# EAGLE design sigma_mix (EAGLE 7.6.0)

## Sheet 1 of 3: POWER
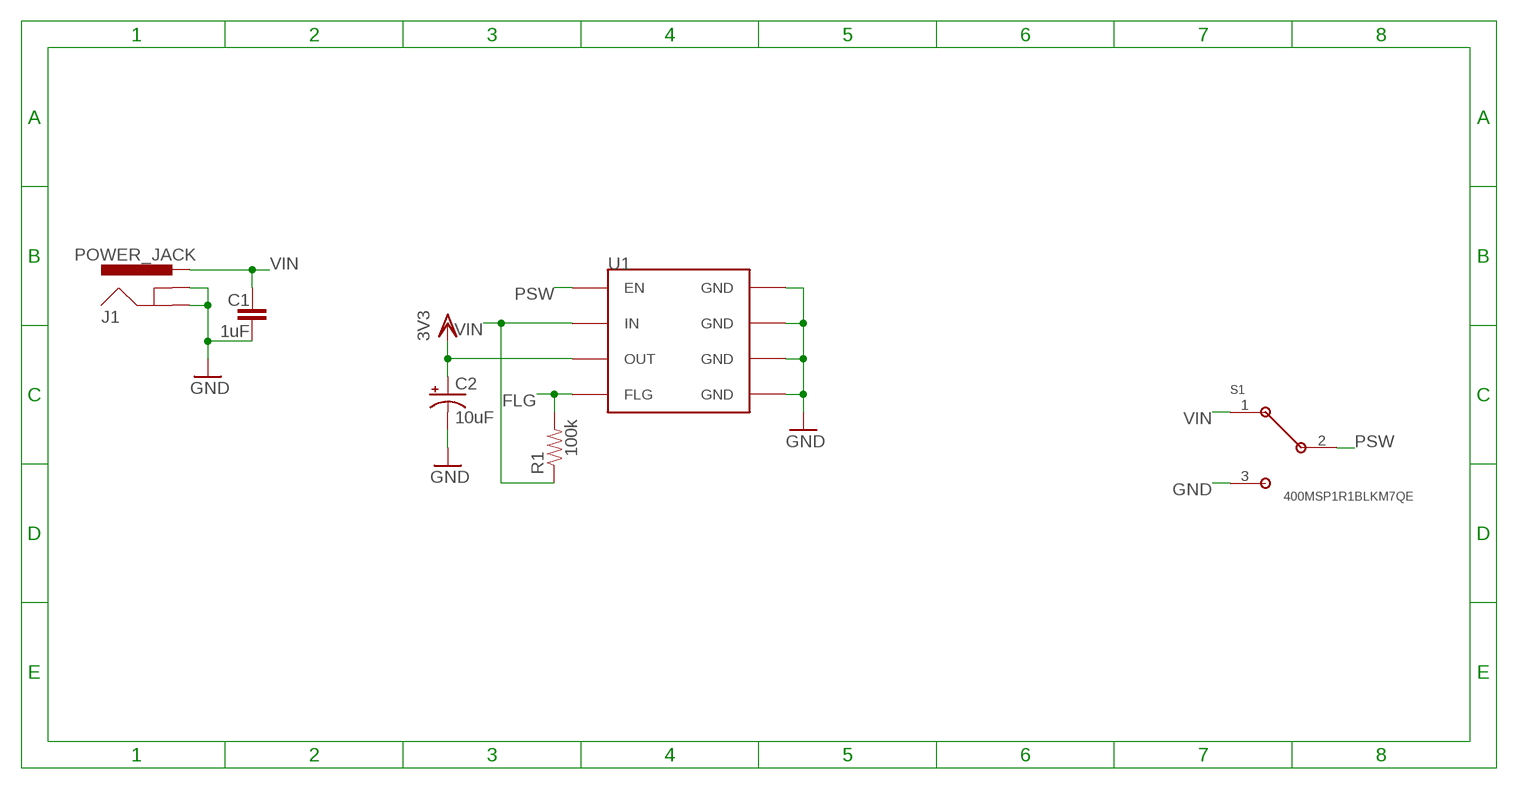
[diagram p0: schematic, sheet 1]

### Parts
C1  1uF  C-EUC2012  [C2012]
C2  10uF  CPOL-USR/2012-12R  [R/2012-12R]
J1  POWER_JACK  POWER_JACKPTH_LOCK  [POWER_JACK_PTH_LOCK]
R1  100k  RESISTOR0603-RES  [0603-RES]
S1  400MSP1R1BLKM7QE  [400MSP1R1BLKM7QE]
U1  MIC39100  [SOIC8]

### Nets
FLG: R1.2 U1.4(FLG)
GND: C1.2 C2.- J1.GND J1.GNDBREAK S1.3 U1.5(GND) U1.6(GND) U1.7(GND) U1.8(GND) ; also sheet 2,3
PSW: S1.2 U1.1(EN)
VDD: C2.+ U1.3(OUT) ; supply symbol labelled 3V3 ; also sheet 2,3
VIN: C1.1 J1.PWR R1.1 S1.1 U1.2(IN)

## Sheet 2 of 3: BLE
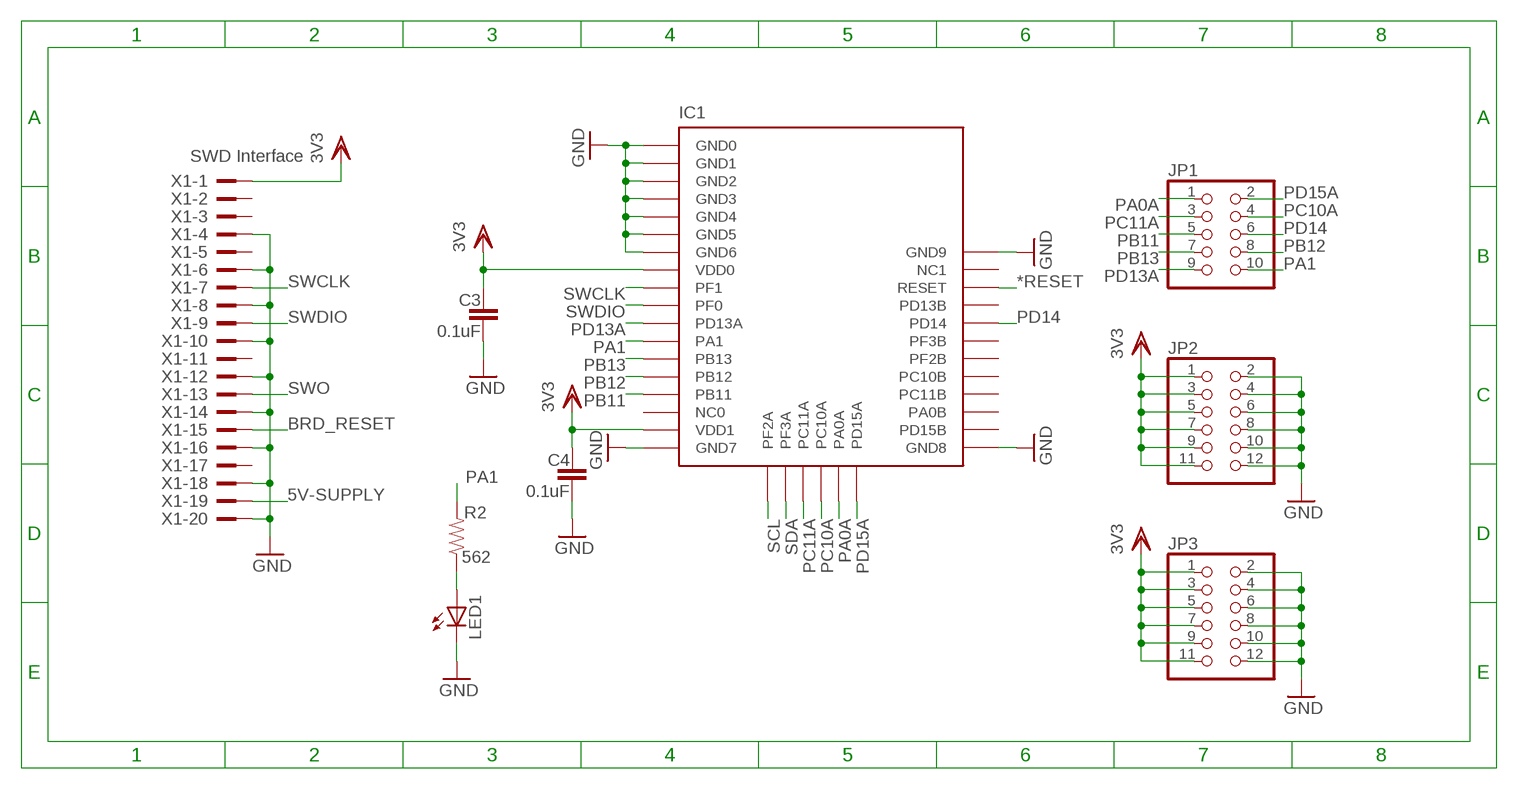
[diagram p1: schematic, sheet 2]

### Parts
C3  0.1uF  C-EUC2012  [C2012]
C4  0.1uF  C-EUC2012  [C2012]
IC1  BGM113  [BLE113]
JP1  PINHD-2X5  [2X05]
JP2  PINHD-2X6  [2X06]
JP3  PINHD-2X6  [2X06]
LED1  LEDCHIPLED_1206  [CHIPLED_1206]
R2  562  RESISTOR0603-RES  [0603-RES]
X1  SWD Interface  2520-  [PAK100/2500-20]

### Nets
5V-SUPPLY: X1.19
*RESET: IC1.P$34(RESET) ; also sheet 3
BRD_RESET: X1.15 ; also sheet 3
GND: C3.2 C4.2 IC1.P$1(GND0) IC1.P$2(GND1) IC1.P$3(GND2) IC1.P$4(GND3) IC1.P$5(GND4) IC1.P$6(GND5) IC1.P$7(GND6) IC1.P$18(GND7) IC1.P$25(GND8) IC1.P$36(GND9) JP2.2 JP2.4 JP2.6 JP2.8 JP2.10 JP2.12 JP3.2 JP3.4 JP3.6 JP3.8 JP3.10 JP3.12 LED1.C X1.4 X1.6 X1.8 X1.10 X1.12 X1.14 X1.16 X1.18 X1.20 ; also sheet 1,3
N$13: LED1.A R2.1
PA0A: IC1.P$23(PA0A) JP1.1
PA1: IC1.P$12(PA1) JP1.10 R2.2
PB11: IC1.P$15(PB11) JP1.5
PB12: IC1.P$14(PB12) JP1.8
PB13: IC1.P$13(PB13) JP1.7
PC10A: IC1.P$22(PC10A) JP1.4
PC11A: IC1.P$21(PC11A) JP1.3
PD13A: IC1.P$11(PD13A) JP1.9
PD14: IC1.P$32(PD14) JP1.6
PD15A: IC1.P$24(PD15A) JP1.2
SCL: IC1.P$19(PF2A) ; also sheet 3
SDA: IC1.P$20(PF3A) ; also sheet 3
SWCLK: IC1.P$9(PF1) X1.7
SWDIO: IC1.P$10(PF0) X1.9
SWO: X1.13
VDD: C3.1 C4.1 IC1.P$8(VDD0) IC1.P$17(VDD1) JP2.1 JP2.3 JP2.5 JP2.7 JP2.9 JP2.11 JP3.1 JP3.3 JP3.5 JP3.7 JP3.9 JP3.11 X1.1 ; supply symbol labelled 3V3 ; also sheet 1,3
Unconnected: IC1.P$16(NC0) IC1.P$26(PD15B) IC1.P$27(PA0B) IC1.P$28(PC11B) IC1.P$29(PC10B) IC1.P$30(PF2B) IC1.P$31(PF3B) IC1.P$33(PD13B) IC1.P$35(NC1) X1.2 X1.3 X1.5 X1.11 X1.17

## Sheet 3 of 3: DSP
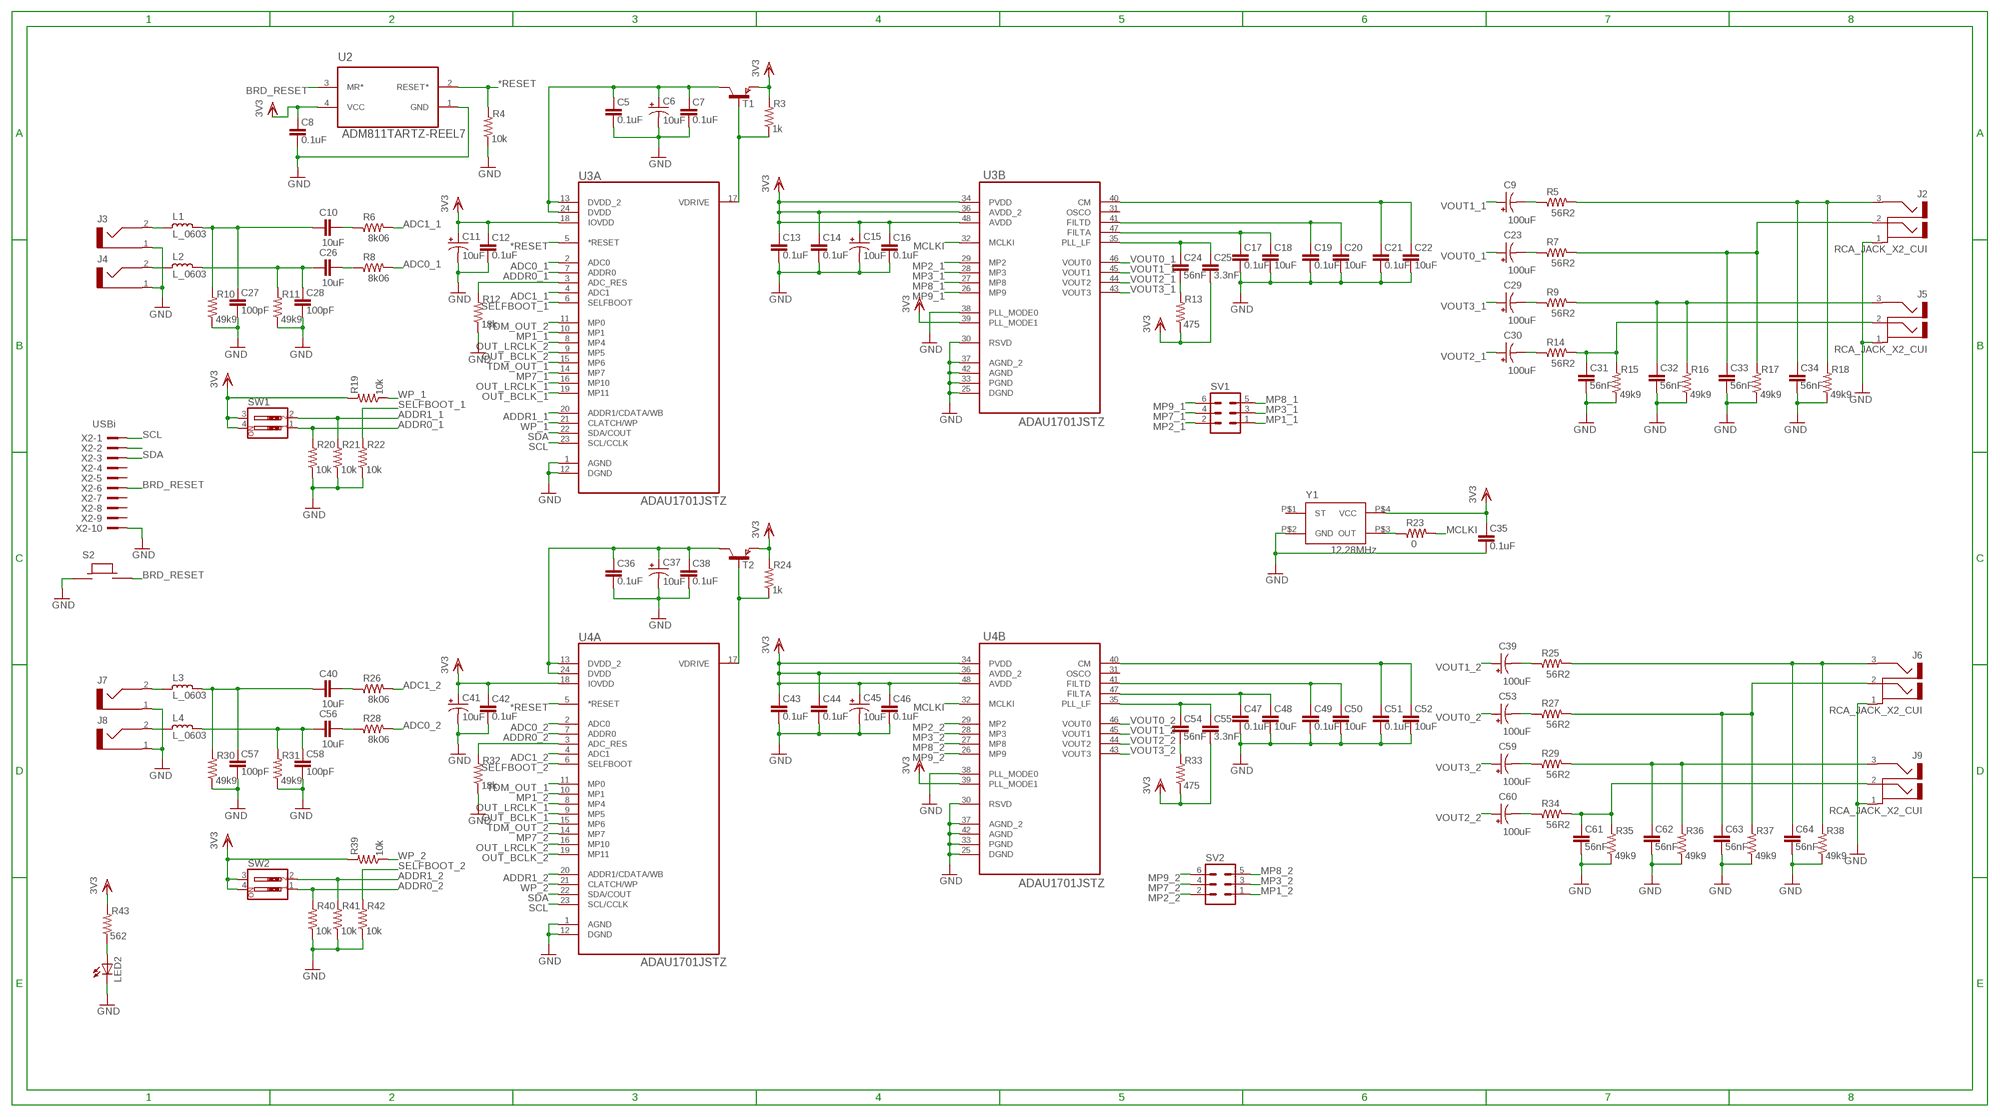
[diagram p2: schematic, sheet 3]

### Parts
C5  0.1uF  C-EUC2012  [C2012]
C6  10uF  CPOL-USR/2012-12R  [R/2012-12R]
C7  0.1uF  C-EUC2012  [C2012]
C8  0.1uF  C-EUC2012  [C2012]
C9  100uF  CPOL-USB/3528-21R  [B/3528-21R]
C10  10uF  C-EUC2012  [C2012]
C11  10uF  CPOL-USR/2012-12R  [R/2012-12R]
C12  0.1uF  C-EUC2012  [C2012]
C13  0.1uF  C-EUC2012  [C2012]
C14  0.1uF  C-EUC2012  [C2012]
C15  10uF  CPOL-USR/2012-12R  [R/2012-12R]
C16  0.1uF  C-EUC2012  [C2012]
C17  0.1uF  C-EUC2012  [C2012]
C18  10uF  C-EUC2012  [C2012]
C19  0.1uF  C-EUC2012  [C2012]
C20  10uF  C-EUC2012  [C2012]
C21  0.1uF  C-EUC2012  [C2012]
C22  10uF  C-EUC2012  [C2012]
C23  100uF  CPOL-USB/3528-21R  [B/3528-21R]
C24  56nF  C-EUC2012  [C2012]
C25  3.3nF  C-EUC2012  [C2012]
C26  10uF  C-EUC2012  [C2012]
C27  100pF  C-EUC2012  [C2012]
C28  100pF  C-EUC2012  [C2012]
C29  100uF  CPOL-USB/3528-21R  [B/3528-21R]
C30  100uF  CPOL-USB/3528-21R  [B/3528-21R]
C31  56nF  C-EUC2012  [C2012]
C32  56nF  C-EUC2012  [C2012]
C33  56nF  C-EUC2012  [C2012]
C34  56nF  C-EUC2012  [C2012]
C35  0.1uF  C-EUC2012  [C2012]
C36  0.1uF  C-EUC2012  [C2012]
C37  10uF  CPOL-USR/2012-12R  [R/2012-12R]
C38  0.1uF  C-EUC2012  [C2012]
C39  100uF  CPOL-USB/3528-21R  [B/3528-21R]
C40  10uF  C-EUC2012  [C2012]
C41  10uF  CPOL-USR/2012-12R  [R/2012-12R]
C42  0.1uF  C-EUC2012  [C2012]
C43  0.1uF  C-EUC2012  [C2012]
C44  0.1uF  C-EUC2012  [C2012]
C45  10uF  CPOL-USR/2012-12R  [R/2012-12R]
C46  0.1uF  C-EUC2012  [C2012]
C47  0.1uF  C-EUC2012  [C2012]
C48  10uF  C-EUC2012  [C2012]
C49  0.1uF  C-EUC2012  [C2012]
C50  10uF  C-EUC2012  [C2012]
C51  0.1uF  C-EUC2012  [C2012]
C52  10uF  C-EUC2012  [C2012]
C53  100uF  CPOL-USB/3528-21R  [B/3528-21R]
C54  56nF  C-EUC2012  [C2012]
C55  3.3nF  C-EUC2012  [C2012]
C56  10uF  C-EUC2012  [C2012]
C57  100pF  C-EUC2012  [C2012]
C58  100pF  C-EUC2012  [C2012]
C59  100uF  CPOL-USB/3528-21R  [B/3528-21R]
C60  100uF  CPOL-USB/3528-21R  [B/3528-21R]
C61  56nF  C-EUC2012  [C2012]
C62  56nF  C-EUC2012  [C2012]
C63  56nF  C-EUC2012  [C2012]
C64  56nF  C-EUC2012  [C2012]
J2  RCA_JACK_X2_CUI  [RCA_JACK_X2_CUI]
J3  RCA_JACK_CUI  [RCA_JACK_CUI]
J4  RCA_JACK_CUI  [RCA_JACK_CUI]
J5  RCA_JACK_X2_CUI  [RCA_JACK_X2_CUI]
J6  RCA_JACK_X2_CUI  [RCA_JACK_X2_CUI]
J7  RCA_JACK_CUI  [RCA_JACK_CUI]
J8  RCA_JACK_CUI  [RCA_JACK_CUI]
J9  RCA_JACK_X2_CUI  [RCA_JACK_X2_CUI]
L1  L_0603  [L0603]
L2  L_0603  [L0603]
L3  L_0603  [L0603]
L4  L_0603  [L0603]
LED2  LEDCHIPLED_1206  [CHIPLED_1206]
R3  1k  RESISTOR0603-RES  [0603-RES]
R4  10k  RESISTOR0603-RES  [0603-RES]
R5  56R2  RESISTOR0603-RES  [0603-RES]
R6  8k06  RESISTOR0603-RES  [0603-RES]
R7  56R2  RESISTOR0603-RES  [0603-RES]
R8  8k06  RESISTOR0603-RES  [0603-RES]
R9  56R2  RESISTOR0603-RES  [0603-RES]
R10  49k9  RESISTOR0603-RES  [0603-RES]
R11  49k9  RESISTOR0603-RES  [0603-RES]
R12  18k  RESISTOR0603-RES  [0603-RES]
R13  475  RESISTOR0603-RES  [0603-RES]
R14  56R2  RESISTOR0603-RES  [0603-RES]
R15  49k9  RESISTOR0603-RES  [0603-RES]
R16  49k9  RESISTOR0603-RES  [0603-RES]
R17  49k9  RESISTOR0603-RES  [0603-RES]
R18  49k9  RESISTOR0603-RES  [0603-RES]
R19  10k  RESISTOR0603-RES  [0603-RES]
R20  10k  RESISTOR0603-RES  [0603-RES]
R21  10k  RESISTOR0603-RES  [0603-RES]
R22  10k  RESISTOR0603-RES  [0603-RES]
R23  0  RESISTOR0603-RES  [0603-RES]
R24  1k  RESISTOR0603-RES  [0603-RES]
R25  56R2  RESISTOR0603-RES  [0603-RES]
R26  8k06  RESISTOR0603-RES  [0603-RES]
R27  56R2  RESISTOR0603-RES  [0603-RES]
R28  8k06  RESISTOR0603-RES  [0603-RES]
R29  56R2  RESISTOR0603-RES  [0603-RES]
R30  49k9  RESISTOR0603-RES  [0603-RES]
R31  49k9  RESISTOR0603-RES  [0603-RES]
R32  18k  RESISTOR0603-RES  [0603-RES]
R33  475  RESISTOR0603-RES  [0603-RES]
R34  56R2  RESISTOR0603-RES  [0603-RES]
R35  49k9  RESISTOR0603-RES  [0603-RES]
R36  49k9  RESISTOR0603-RES  [0603-RES]
R37  49k9  RESISTOR0603-RES  [0603-RES]
R38  49k9  RESISTOR0603-RES  [0603-RES]
R39  10k  RESISTOR0603-RES  [0603-RES]
R40  10k  RESISTOR0603-RES  [0603-RES]
R41  10k  RESISTOR0603-RES  [0603-RES]
R42  10k  RESISTOR0603-RES  [0603-RES]
R43  562  RESISTOR0603-RES  [0603-RES]
S2  OMRON_B3M  [OMRON_B3M]
SV1  MA03-2  [MA03-2]
SV2  MA03-2  [MA03-2]
SW1  SW_DIP-2  [EDG-02]
SW2  SW_DIP-2  [EDG-02]
T1  PNPSOT23  [SOT-23]
T2  PNPSOT23  [SOT-23]
U2  ADM811TARTZ-REEL7  [SOT143P290X130-4N]
U3  ADAU1701JSTZ  [QFP50P900X900X160-48N]
U4  ADAU1701JSTZ  [QFP50P900X900X160-48N]
X2  USBi  2510-  [PAK100/2500-10]
Y1  12.28MHz  XTAL-OSC  [SG-210]

### Nets
*RESET: R4.2 U2.2(RESET*) U3.5(A:*RESET) U4.5(A:*RESET) ; also sheet 2
ADC0_1: R8.2 U3.2(A:ADC0)
ADC0_2: R28.2 U4.2(A:ADC0)
ADC1_1: R6.2 U3.4(A:ADC1)
ADC1_2: R26.2 U4.4(A:ADC1)
ADDR0_1: R20.2 SW1.1 U3.7(A:ADDR0)
ADDR0_2: R40.2 SW2.1 U4.7(A:ADDR0)
ADDR1_1: R21.2 SW1.2 U3.20(A:ADDR1/CDATA/WB)
ADDR1_2: R41.2 SW2.2 U4.20(A:ADDR1/CDATA/WB)
BRD_RESET: S2.P$2 U2.3(MR*) X2.6 ; also sheet 2
DVDD: C5.1 C6.+ C7.1 T1.1(C) U3.13(A:DVDD_2) U3.24(A:DVDD)
GND: C5.2 C6.- C7.2 C8.2 C11.- C12.2 C13.2 C14.2 C15.- C16.2 C17.2 C18.2 C19.2 C20.2 C21.2 C22.2 C27.2 C28.2 C31.2 C32.2 C33.2 C34.2 C35.2 C36.2 C37.- C38.2 C41.- C42.2 C43.2 C44.2 C45.- C46.2 C47.2 C48.2 C49.2 C50.2 C51.2 C52.2 C57.2 C58.2 C61.2 C62.2 C63.2 C64.2 J2.1 J3.1 J4.1 J5.1 J6.1 J7.1 J8.1 J9.1 LED2.C R4.1 R10.1 R11.1 R12.1 R15.1 R16.1 R17.1 R18.1 R20.1 R21.1 R22.1 R30.1 R31.1 R32.1 R35.1 R36.1 R37.1 R38.1 R40.1 R41.1 R42.1 S2.P$1 U2.1(GND) U3.1(A:AGND) U3.12(A:DGND) U3.25(B:DGND) U3.30(B:RSVD) U3.33(B:PGND) U3.37(B:AGND_2) U3.38(B:PLL_MODE0) U3.42(B:AGND) U4.1(A:AGND) U4.12(A:DGND) U4.25(B:DGND) U4.30(B:RSVD) U4.33(B:PGND) U4.37(B:AGND_2) U4.38(B:PLL_MODE0) U4.42(B:AGND) X2.10 Y1.P$2(GND) ; also sheet 1,2
MCLKI: R23.2 U3.32(B:MCLKI) U4.32(B:MCLKI)
MP1_1: SV1.1 U3.10(A:MP1)
MP1_2: SV2.1 U4.10(A:MP1)
MP2_1: SV1.2 U3.29(B:MP2)
MP2_2: SV2.2 U4.29(B:MP2)
MP3_1: SV1.3 U3.28(B:MP3)
MP3_2: SV2.3 U4.28(B:MP3)
MP7_1: SV1.4 U3.14(A:MP7)
MP7_2: SV2.4 U4.14(A:MP7)
MP8_1: SV1.5 U3.27(B:MP8)
MP8_2: SV2.5 U4.27(B:MP8)
MP9_1: SV1.6 U3.26(B:MP9)
MP9_2: SV2.6 U4.26(B:MP9)
N$1: R3.1 T1.3(B) U3.17(A:VDRIVE)
N$2: C24.2 R13.2
N$3: C24.1 C25.1 U3.35(B:PLL_LF)
N$4: C17.1 C18.1 U3.47(B:FILTA)
N$5: R23.1 Y1.P$3(OUT)
N$6: C19.1 C20.1 U3.41(B:FILTD)
N$7: C21.1 C22.1 U3.40(B:CM)
N$8: R12.2 U3.3(A:ADC_RES)
N$9: LED2.A R43.1
N$10: C10.2 C27.1 L1.1 R10.2
N$11: X2.2
N$12: C10.1 R6.1
N$15: C26.2 C28.1 L2.1 R11.2
N$16: C26.1 R8.1
N$19: C9.- R5.1
N$20: J3.2 L1.2
N$21: C23.- R7.1
N$22: C29.- R9.1
N$24: C30.- R14.1
N$26: C31.1 J5.2 R14.2 R15.2
N$28: C32.1 J5.3 R9.2 R16.2
N$33: C33.1 J2.2 R7.2 R17.2
N$34: C34.1 J2.3 R5.2 R18.2
N$35: J4.2 L2.2
N$36: R24.1 T2.3(B) U4.17(A:VDRIVE)
N$37: C36.1 C37.+ C38.1 T2.1(C) U4.13(A:DVDD_2) U4.24(A:DVDD)
N$38: C54.2 R33.2
N$39: C54.1 C55.1 U4.35(B:PLL_LF)
N$40: C47.1 C48.1 U4.47(B:FILTA)
N$41: C49.1 C50.1 U4.41(B:FILTD)
N$42: C51.1 C52.1 U4.40(B:CM)
N$44: R32.2 U4.3(A:ADC_RES)
N$46: C40.2 C57.1 L3.1 R30.2
N$47: C40.1 R26.1
N$48: C56.2 C58.1 L4.1 R31.2
N$49: C56.1 R28.1
N$50: C39.- R25.1
N$51: C53.- R27.1
N$52: C59.- R29.1
N$53: C60.- R34.1
N$54: C61.1 J9.2 R34.2 R35.2
N$55: C62.1 J9.3 R29.2 R36.2
N$56: C63.1 J6.2 R27.2 R37.2
N$57: C64.1 J6.3 R25.2 R38.2
N$58: J7.2 L3.2
N$59: J8.2 L4.2
OUT_BCLK_1: U3.19(A:MP11) U4.9(A:MP5)
OUT_BCLK_2: U3.9(A:MP5) U4.19(A:MP11)
OUT_LRCLK_1: U3.16(A:MP10) U4.8(A:MP4)
OUT_LRCLK_2: U3.8(A:MP4) U4.16(A:MP10)
SCL: U3.23(A:SCL/CCLK) U4.23(A:SCL/CCLK) X2.1 ; also sheet 2
SDA: U3.22(A:SDA/COUT) U4.22(A:SDA/COUT) X2.3 ; also sheet 2
SELFBOOT_1: R22.2 U3.6(A:SELFBOOT)
SELFBOOT_2: R42.2 U4.6(A:SELFBOOT)
TDM_OUT_1: U3.15(A:MP6) U4.11(A:MP0)
TDM_OUT_2: U3.11(A:MP0) U4.15(A:MP6)
VDD: C8.1 C11.+ C12.1 C13.1 C14.1 C15.+ C16.1 C25.2 C35.1 C41.+ C42.1 C43.1 C44.1 C45.+ C46.1 C55.2 R3.2 R13.1 R19.2 R24.2 R33.1 R39.2 R43.2 SW1.3 SW1.4 SW2.3 SW2.4 T1.2(E) T2.2(E) U2.4(VCC) U3.18(A:IOVDD) U3.34(B:PVDD) U3.36(B:AVDD_2) U3.39(B:PLL_MODE1) U3.48(B:AVDD) U4.18(A:IOVDD) U4.34(B:PVDD) U4.36(B:AVDD_2) U4.39(B:PLL_MODE1) U4.48(B:AVDD) Y1.P$4(VCC) ; supply symbol labelled 3V3 ; also sheet 1,2
VOUT0_1: C23.+ U3.46(B:VOUT0)
VOUT0_2: C53.+ U4.46(B:VOUT0)
VOUT1_1: C9.+ U3.45(B:VOUT1)
VOUT1_2: C39.+ U4.45(B:VOUT1)
VOUT2_1: C30.+ U3.44(B:VOUT2)
VOUT2_2: C60.+ U4.44(B:VOUT2)
VOUT3_1: C29.+ U3.43(B:VOUT3)
VOUT3_2: C59.+ U4.43(B:VOUT3)
WP_1: R19.1 U3.21(A:CLATCH/WP)
WP_2: R39.1 U4.21(A:CLATCH/WP)
Unconnected: U3.31(B:OSCO) U4.31(B:OSCO) X2.4 X2.5 X2.7 X2.8 X2.9 Y1.P$1(ST)

## Library data of the parts
C1 C3-C5 C7 C8 C10 C12-C14 C16-C22 C24-C28 C31-C36 C38 C40 C42-C44 C46-C52 C54-C58 C61-C64 = rcl:C-EU: CAPACITOR, European symbol
C2 C6 C9 C11 C15 C23 C29 C30 C37 C39 C41 C45 C53 C59 C60 = rcl:CPOL-US: POLARIZED CAPACITOR, American symbol
IC1 = tkrworks:BGM113
J1 = SparkFun:POWER_JACK: Power Jack This is the standard 5.5mm barrel jack for power. The PTH is the most common, proven, reliable, footprint. All others are experimental. The Slot footprint only works if the mill layer is transmitted to the PCB fab house so be warned. Spark Fun Electronics SKU : PRT-00119. Mating wall wart : TOL-00298 (and others)
J2 J5 J6 J9 = tkrworks:RCA_JACK_X2_CUI
J3 J4 J7 J8 = tkrworks:RCA_JACK_CUI
JP1 = pinhead:PINHD-2X5: PIN HEADER
JP2 JP3 = pinhead:PINHD-2X6: PIN HEADER
L1-L4 = rc-master-smd:L_: INDUCTOR
LED1 LED2 = myled:LED: LED OSRAM: - CHIPLED LG R971, LG N971, LY N971, LG Q971, LY Q971, LO R971, LY R971 LH N974, LH R974 LS Q976, LO Q976, LY Q976 LO Q996 - Hyper CHIPLED LW Q18S LB Q993, LB Q99A, LB R99A - SideLED LS A670, LO A670, LY A670, LG A670, LP A670 LB A673, LV A673, LT A673, LW A673 LH A674 LY A675 LS A676, LA A676, LO A676, LY A676, LW A676 LS A679, LY A679, LG A679 - Hyper Micro SIDELED® LS Y876, LA Y876, LO Y876, LY Y876 LT Y87S - SmartLED LW L88C, LW L88S LB L89C, LB L89S, LG L890 LS L89K, LO L89K, LY L89K LS L896, LA L896, LO L896, LY L896 - TOPLED LS T670, LO T670, LY T670, LG T670, LP T670 LSG T670, LSP T670, LSY T670, LOP T670, LYG T670 LG T671, LOG T671, LSG T671 LB T673, LV T673, LT T673, LW T673 LH T674 LS T676, LA T676, LO T676, LY T676, LB T676, LH T676, LSB T676, LW T676 LB T67C, LV T67C, LT T67C, LS T67K, LO T67K, LY T67K, LW E67C LS E67B, LA E67B, LO E67B, LY E67B, LB E67C, LV E67C, LT E67C LW T67C LS T679, LY T679, LG T679 LS T770, LO T770, LY T770, LG T770, LP T770 LB T773, LV T773, LT T773, LW T773 LH T774 LS E675, LA E675, LY E675, LS T675 LS T776, LA T776, LO T776, LY T776, LB T776 LHGB T686 LT T68C, LB T68C - Hyper Mini TOPLED® LB M676 - Mini TOPLED Santana® LG M470 LS M47K, LO M47K, LY M47K Source: http://www.osram.convergy.de LUXEON: - LUMILED® LXK2-PW12-R00, LXK2-PW12-S00, LXK2-PW14-U00, LXK2-PW14-V00 LXK2-PM12-R00, LXK2-PM12-S00, LXK2-PM14-U00 LXK2-PE12-Q00, LXK2-PE12-R00, LXK2-PE12-S00, LXK2-PE14-T00, LXK2-PE14-U00 LXK2-PB12-K00, LXK2-PB12-L00, LXK2-PB12-M00, LXK2-PB14-N00, LXK2-PB14-P00, LXK2-PB14-Q00 LXK2-PR12-L00, LXK2-PR12-M00, LXK2-PR14-Q00, LXK2-PR14-R00 LXK2-PD12-Q00, LXK2-PD12-R00, LXK2-PD12-S00 LXK2-PH12-R00, LXK2-PH12-S00 LXK2-PL12-P00, LXK2-PL12-Q00, LXK2-PL12-R00 Source: www.luxeon.com KINGBRIGHT: KA-3528ASYC Source: www.kingbright.com
R1-R43 = SparkFun:RESISTOR: Resistor Basic schematic elements and footprints for 0603, 1206, and PTH resistors.
S1 = tkrworks:400MSP1R1BLKM7QE
S2 = tkrworks:OMRON_B3M
SV1 SV2 = con-lstb:MA03-2: PIN HEADER; OC_FARNELL: unknown; OC_NEWARK: unknown
SW1 SW2 = special:SW_DIP-2: DIP SWITCH
T1 T2 = zetex:PNPSOT23: PNP TRANSISTOR; MPN: DSS20200L-7; OC_FARNELL: unknown; OC_NEWARK: 25R4554
U1 = tkrworks:MIC39100
U2 = ADI-Phase-2:ADM811TARTZ-REEL7: Microprocessor Supervisory Circuits
U3 U4 = ADI-Phase-2:ADAU1701JSTZ: SigmaDSP 28-/56-Bit Audio Processor; MPN: ADAU1701JSTZ; OC_FARNELL: 1498728; OC_NEWARK: 28M3496; PACKAGE: LQFP-48; SUPPLIER: Analog Devices
X1 = con-3m:2520-: 3M (TM) Pak 100 4-Wall Header Source: 3M; OC_FARNELL: unknown; OC_NEWARK: unknown
X2 = con-3m:2510-: 3M (TM) Pak 100 4-Wall Header Source: 3M; MF: 3M; MPN: 2510-6002UB; OC_FARNELL: 9838244; OC_NEWARK: 46F4725
Y1 = tkrworks2:XTAL-OSC

## Board
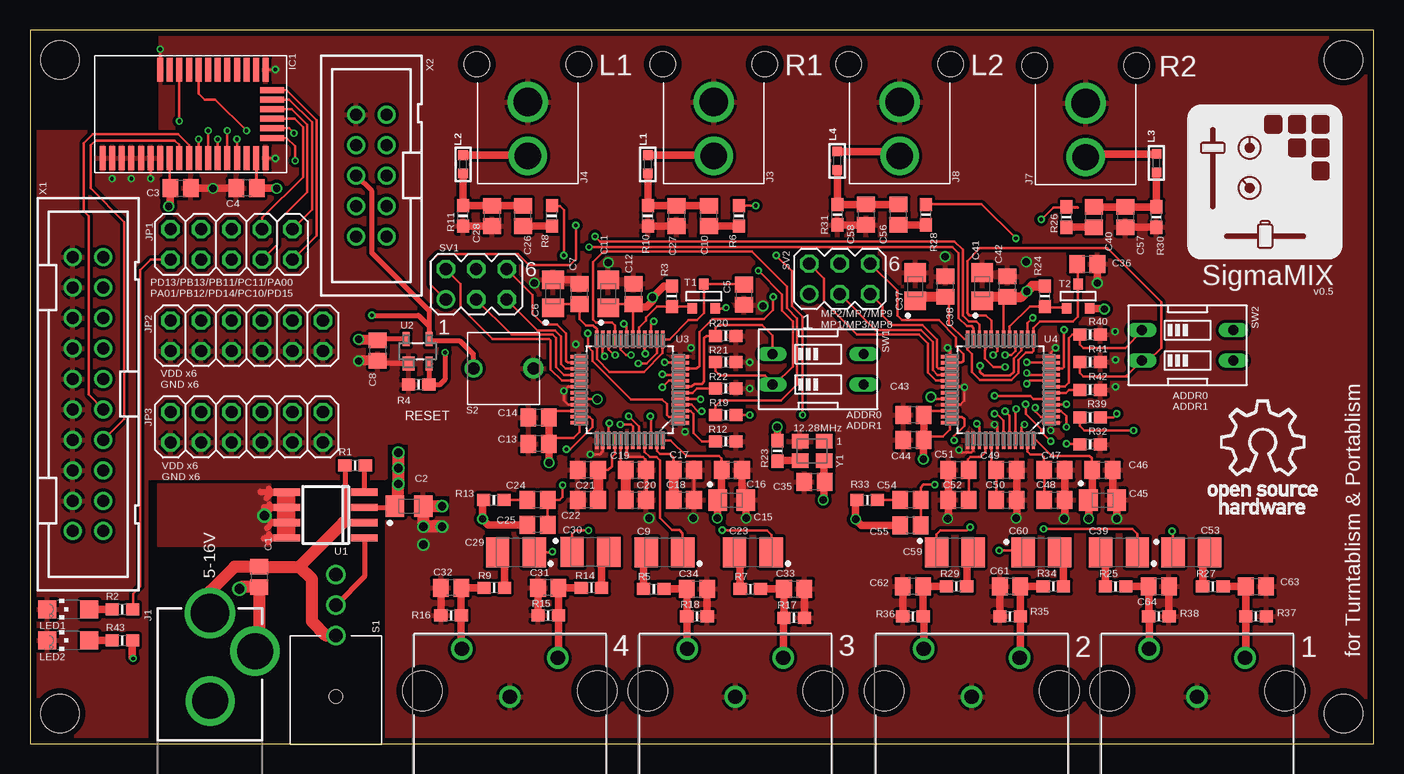
[diagram p3: board, top side]
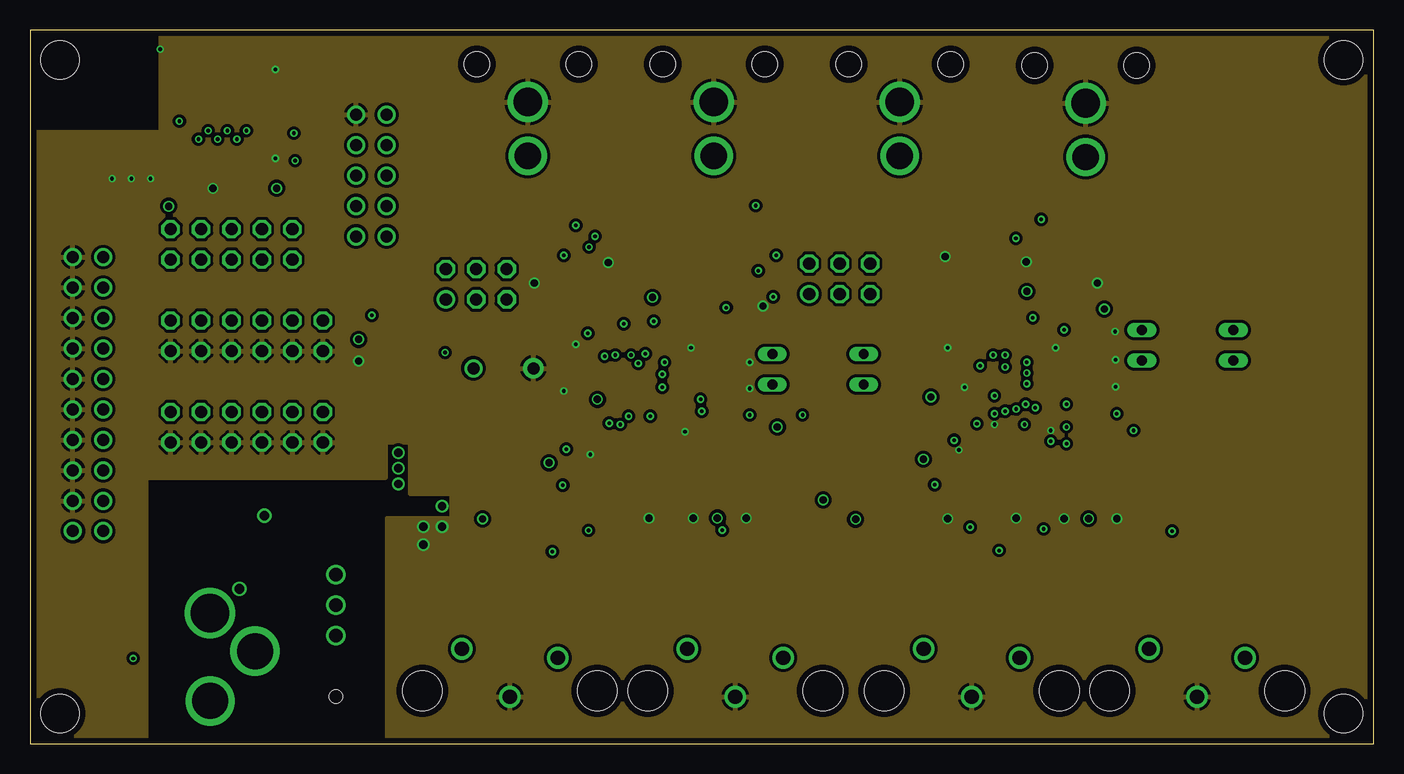
[diagram p4: board, inner layer Route2]
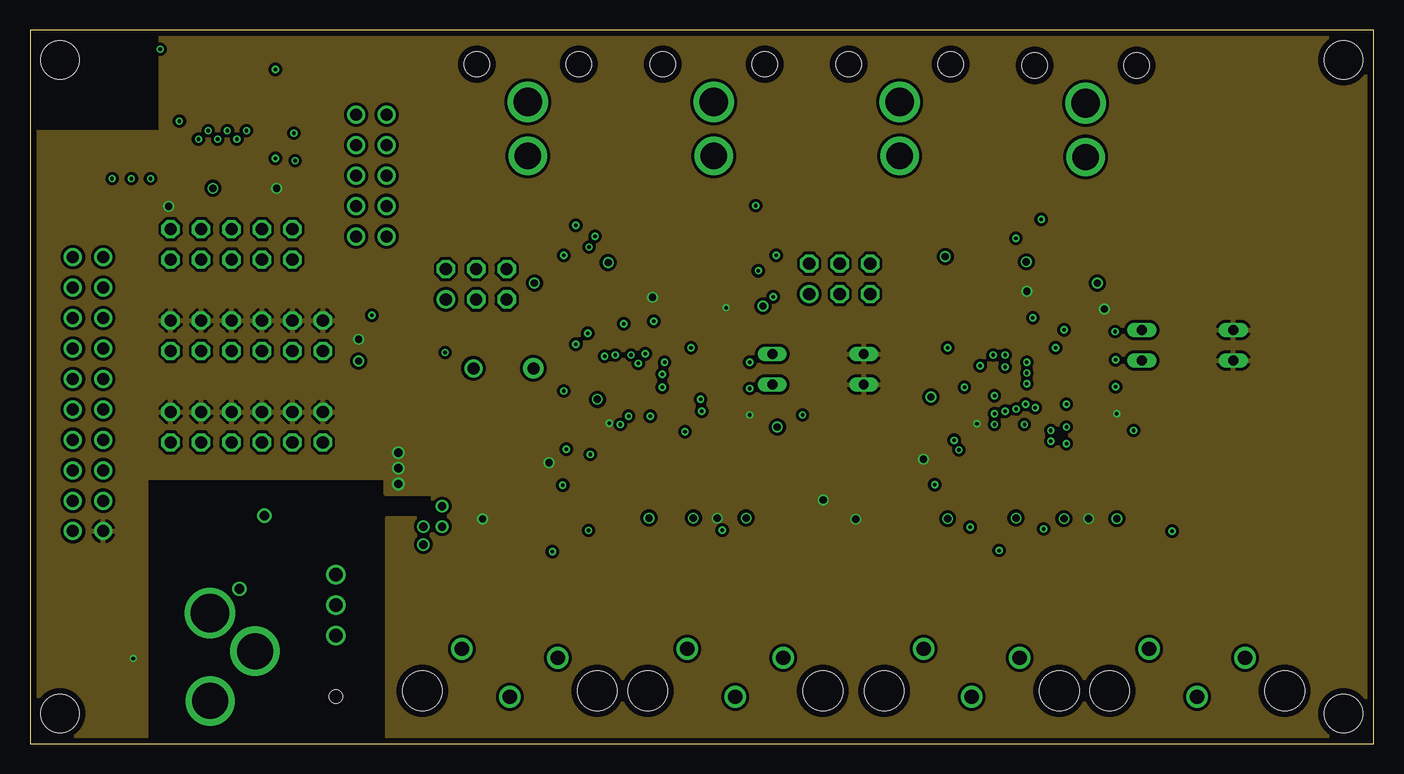
[diagram p5: board, inner layer Route3]
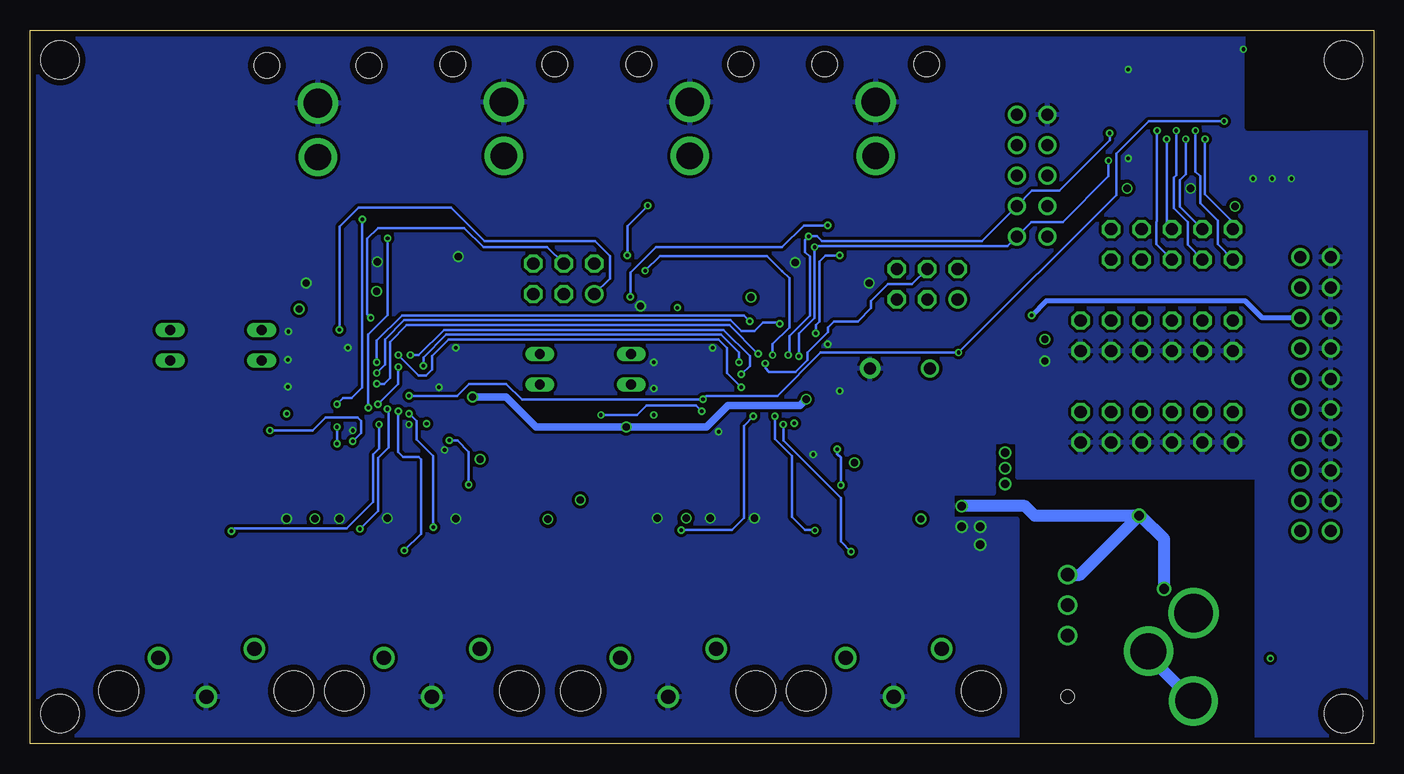
[diagram p6: board, bottom side, seen from below]

Size 112 x 59.5 mm. Coordinates in mm from the lower left corner, seen from the top.
Outline: 0,59.5 0,0 112,0 112,59.5 0,59.5
Copper layers (1+2*3+16): Top 0.018mm / dielectric 0.25mm / Route2 0.035mm / dielectric 1mm / Route3 0.035mm / dielectric 0.2mm / Bottom 0.018mm
Design rules "pban_5mil-l4-a": minimum track width 5mil, minimum drill 0.3mm, track to track 5mil, track to pad 0.229mm, pad to pad 5mil, via to via 5mil, smd to smd 5mil, copper to edge 0.5mm, drill to drill 0.5mm, minimum pad ring 0.15mm, minimum via ring 0.15mm, stop-mask expansion 4mil, vias tented up to drill 0.35mm, thermal gap 10mil
Holes 3.2 mm at 2.5,57 2.5,2.5 109.5,57 109.5,2.5

### Footprints (pad centres in the part's own frame; a part is rotated, then mirrored left to right if it is on the bottom)
C2012 = smd 1.3 x 1.5: 1 -0.85,0; 2 0.85,0
R/2012-12R = smd 1.55 x 1.8: + 1.175,0; - -1.175,0
B/3528-21R = smd 1.95 x 2.5: + 1.525,0; - -1.525,0
BLE113 = smd 2 x 0.5: P$1 -3.675,6.8; P$2 -3.675,6; P$3 -3.675,5.2; P$4 -3.675,4.4; P$5 -3.675,3.6; P$6 -3.675,2.8; P$7 -3.675,2; P$8 -3.675,1.2; P$9 -3.675,0.4; P$10 -3.675,-0.4; P$11 -3.675,-1.2; P$12 -3.675,-2; P$13 -3.675,-2.8; P$14 -3.675,-3.6; P$15 -3.675,-4.4; P$16 -3.675,-5.2; P$17 -3.675,-6; P$18 -3.675,-6.8; P$25 3.675,-6.8; P$26 3.675,-6; P$27 3.675,-5.2; P$28 3.675,-4.4; P$29 3.675,-3.6; P$30 3.675,-2.8; P$31 3.675,-2; P$32 3.675,-1.2; P$33 3.675,-0.4; P$34 3.675,0.4; P$35 3.675,1.2; P$36 3.675,2 | smd 0.5 x 2: P$19 -2,-7.35; P$20 -1.2,-7.35; P$21 -0.4,-7.35; P$22 0.4,-7.35; P$23 1.2,-7.35; P$24 2,-7.35
POWER_JACK_PTH_LOCK = drill 2.997 pad 4.115: GND 0.025,6.557; GNDBREAK 3.762,10.7 | drill 3.2 pad 4.115: PWR 0,13.878
RCA_JACK_X2_CUI = drill 1.2: 1 0,0; 2 -4,-3.25; 3 4,-4 | hole 3.3: -7.3,-0.5; 7.3,-0.5
RCA_JACK_CUI = drill 2.4: 1 -4,0 | drill 2.2: 2 -8.5,0 | hole 2.1: -0.85,-4.25; -0.85,4.25
2X05 = drill 1.016 octagon: 1 -5.08,-1.27; 2 -5.08,1.27; 3 -2.54,-1.27; 4 -2.54,1.27; 5 0,-1.27; 6 0,1.27; 7 2.54,-1.27; 8 2.54,1.27; 9 5.08,-1.27; 10 5.08,1.27
2X06 = drill 1.016 octagon: 1 -6.35,-1.27; 2 -6.35,1.27; 3 -3.81,-1.27; 4 -3.81,1.27; 5 -1.27,-1.27; 6 -1.27,1.27; 7 1.27,-1.27; 8 1.27,1.27; 9 3.81,-1.27; 10 3.81,1.27; 11 6.35,-1.27; 12 6.35,1.27
L0603 = smd 0.8 x 0.8: 1 -0.762,0; 2 0.762,0
CHIPLED_1206 = smd 1.5 x 1.5: A 0,-1.75; C 0,1.75
0603-RES = smd 1.1 x 1: 1 -0.85,0; 2 0.85,0
400MSP1R1BLKM7QE = drill 1.1: 1 0,0; 2 2.54,0; 3 5.08,0 | hole 1.1: -5.08,0
OMRON_B3M = drill 1 pad 1.676: P$1 -2.5,0 | drill 1: P$2 2.5,0
MA03-2 = drill 1.016: 1 -2.54,-1.27 | drill 1.016 octagon: 2 -2.54,1.27; 3 0,-1.27; 4 0,1.27; 5 2.54,-1.27; 6 2.54,1.27
EDG-02 = drill 0.813 long: 1 -1.27,-3.81; 2 1.27,-3.81; 3 1.27,3.81; 4 -1.27,3.81
SOT-23 = smd 0.787 x 0.889: 1 0.025,-1.016; 2 -0.94,1.016; 3 0.991,1.016
SOIC8 = smd 0.6 x 2.2: 1 -1.905,-3.235; 2 -0.635,-3.235; 3 0.635,-3.235; 4 1.905,-3.235; 5 1.905,3.235; 6 0.635,3.235; 7 -0.635,3.235; 8 -1.905,3.235
SOT143P290X130-4N = smd 1 x 1.2: 1 -0.76,-1.02 | smd 0.6 x 1.2: 2 0.96,-1.02; 3 0.96,1.02; 4 -0.96,1.02
QFP50P900X900X160-48N = smd 1.473 x 0.279: 1 -4.216,2.743; 2 -4.216,2.261; 3 -4.216,1.753; 4 -4.216,1.245; 5 -4.216,0.762; 6 -4.216,0.254; 7 -4.216,-0.254; 8 -4.216,-0.762; 9 -4.216,-1.245; 10 -4.216,-1.753; 11 -4.216,-2.261; 12 -4.216,-2.743; 25 4.216,-2.743; 26 4.216,-2.261; 27 4.216,-1.753; 28 4.216,-1.245; 29 4.216,-0.762; 30 4.216,-0.254; 31 4.216,0.254; 32 4.216,0.762; 33 4.216,1.245; 34 4.216,1.753; 35 4.216,2.261; 36 4.216,2.743 | smd 0.279 x 1.473: 13 -2.743,-4.216; 14 -2.261,-4.216; 15 -1.753,-4.216; 16 -1.245,-4.216; 17 -0.762,-4.216; 18 -0.254,-4.216; 19 0.254,-4.216; 20 0.762,-4.216; 21 1.245,-4.216; 22 1.753,-4.216; 23 2.261,-4.216; 24 2.743,-4.216; 37 2.743,4.216; 38 2.261,4.216; 39 1.753,4.216; 40 1.245,4.216; 41 0.762,4.216; 42 0.254,4.216; 43 -0.254,4.216; 44 -0.762,4.216; 45 -1.245,4.216; 46 -1.753,4.216; 47 -2.261,4.216; 48 -2.743,4.216
PAK100/2500-20 = drill 1 pad 1.422: 1 -11.43,-1.27; 2 -11.43,1.27; 3 -8.89,-1.27; 4 -8.89,1.27; 5 -6.35,-1.27; 6 -6.35,1.27; 7 -3.81,-1.27; 8 -3.81,1.27; 9 -1.27,-1.27; 10 -1.27,1.27; 11 1.27,-1.27; 12 1.27,1.27; 13 3.81,-1.27; 14 3.81,1.27; 15 6.35,-1.27; 16 6.35,1.27; 17 8.89,-1.27; 18 8.89,1.27; 19 11.43,-1.27; 20 11.43,1.27
PAK100/2500-10 = drill 1 pad 1.422: 1 -5.08,-1.27; 2 -5.08,1.27; 3 -2.54,-1.27; 4 -2.54,1.27; 5 0,-1.27; 6 0,1.27; 7 2.54,-1.27; 8 2.54,1.27; 9 5.08,-1.27; 10 5.08,1.27
SG-210 = smd 1.4 x 1.2: P$1 -1,-0.8; P$2 1,-0.8; P$3 1,0.8; P$4 -1,0.8

### Placement (x,y rotation side)
C1  19.1,13.9 270 top
C2  31.6,19.8 180 top
C3  12.55,46.3 0 top
C4  18.05,46.3 180 top
C5  59.5,37.42 270 top
C6  43.6,37.5 270 top
C7  45.8,37.5 90 top
C8  28.99,32.78 270 top
C9  52.89,15.95 0 top
C10  56.6,44 90 top
C11  48.2,37.5 270 top
C12  50.3,37.5 90 top
C13  42.4,25 180 top
C14  42.4,27.2 180 top
C15  58.5,20.3 180 top
C16  58.5,22.8 0 top
C17  54.5,22.8 0 top
C18  54.5,20.3 0 top
C19  50.5,22.8 0 top
C20  50.5,20.3 0 top
C21  46.5,22.8 180 top
C22  46.5,20.3 180 top
C23  60.25,15.95 0 top
C24  42.3,20.3 180 top
C25  42.3,18.25 180 top
C26  41.1,44 90 top
C27  53.9,44 270 top
C28  38.5,44 270 top
C29  40.5,15.95 0 top
C30  46.71,15.98 180 top
C31  43.2,13 180 top
C32  35.1,13 180 top
C33  63.7,12.9 0 top
C34  55.6,12.9 0 top
C35  65.4,21.8 180 top
C36  88.13,39.99 0 top
C37  73.8,38.1 270 top
C38  76.3,38.1 90 top
C39  90.79,15.95 0 top
C40  88.7,43.9 90 top
C41  79.38,38.1 270 top
C42  81.47,38.1 90 top
C43  73.65,27.4 180 top
C44  73.65,25.3 180 top
C45  89.4,20.3 180 top
C46  89.4,22.8 0 top
C47  85.4,22.8 0 top
C48  85.4,20.3 0 top
C49  81.4,22.8 0 top
C50  81.4,20.3 0 top
C51  77.4,22.8 180 top
C52  77.4,20.3 180 top
C53  96.8,15.95 180 top
C54  73.4,20.3 180 top
C55  73.4,18.2 180 top
C56  72.4,44.1 90 top
C57  91.3,43.9 270 top
C58  69.7,44.1 270 top
C59  77.1,15.95 180 top
C60  84.3,15.95 180 top
C61  81.7,13.1 180 top
C62  73.6,13.1 180 top
C63  102.2,13.1 0 top
C64  94.1,13.1 0 top
IC1  12.85,52.5 90 top
J1  15,-3 0 top
J2  58.8,3.9 180 top
J3  57,57.5 90 top
J4  41.5,57.5 90 top
J5  40,3.9 180 top
J6  97.3,3.9 180 top
J7  88,57.4 90 top
J8  72.5,57.5 90 top
J9  78.5,3.9 180 top
JP1  16.8,41.62 180 top
JP2  18.07,34 180 top
JP3  18.07,26.38 180 top
L1  51.5,48.3 90 top
L2  36.1,48.3 90 top
L3  93.9,48.4 90 top
L4  67.3,48.6 90 top
LED1  3.2,11.2 90 top
LED2  3.2,8.6 90 top
R1  27.1,23.2 0 top
R2  7.7,11.2 0 top
R3  53.5,37.3 90 top
R4  32.4,29.95 0 top
R5  52,12.9 0 top
R6  59.1,44 90 top
R7  60.05,12.9 0 top
R8  43.5,44 90 top
R9  38.7,13 180 top
R10  51.5,44 90 top
R11  36.1,44 90 top
R12  58,25.2 180 top
R13  38.67,20.3 0 top
R14  46.8,13 180 top
R15  43.2,10.7 0 top
R16  35.1,10.7 0 top
R17  63.7,10.5 180 top
R18  55.6,10.6 180 top
R19  58,27.4 0 top
R20  58,34 180 top
R21  58,31.8 180 top
R22  58,29.6 180 top
R23  62.3,24.4 90 top
R24  84.6,37.3 90 top
R25  90.5,13.1 0 top
R26  86.4,43.9 90 top
R27  98.6,13.1 0 top
R28  74.7,44.1 90 top
R29  77.24,13.1 180 top
R30  93.9,43.9 90 top
R31  67.3,44.1 90 top
R32  88.38,24.94 180 top
R33  69.8,20.3 0 top
R34  85.3,13.1 180 top
R35  81.7,10.6 0 top
R36  73.6,10.6 0 top
R37  102.2,10.6 180 top
R38  94.1,10.6 180 top
R39  88.37,27.2 0 top
R40  88.38,34.09 180 top
R41  88.37,31.8 180 top
R42  88.38,29.5 180 top
R43  7.7,8.6 0 top
S1  25.5,9 90 top
S2  39.46,31.29 180 top
SV1  37.2,38.3 0 top
SV2  67.5,38.75 0 top
SW1  65.7,31.2 270 top
SW2  96.5,33.2 270 top
T1  56.2,37.3 180 top
T2  87.4,37.3 180 top
U1  24.65,19.05 90 top
U2  32.32,32.71 0 top
U3  50,29.5 180 top
U4  80.9,29.5 180 top
X1  4.85,29.14 90 top
X2  28.46,47.37 90 top
Y1  65.2,24.4 180 top

### Tracks (layer width: path | path; a pad name or v marks a point on that pad's centre or on a via)
*RESET  (via drill 0.3)
  Top 0.2: U4.5 83.66,28.74 83.4,29 v80.4,29 | U3.5 55.86,28.74 v55.9,28.7 | IC1.P$34 v12.45,51.9
  Top 0.254: 33.4,31.68 U2.2
  Top 0.406: v34.6,32.6 34.6,30.35 34.2,29.95 R4.2 33.25,31.53 33.4,31.68
  Bottom 0.2: v12.45,51.9 18.75,51.9 21.45,49.2 21.45,45.75 v34.6,32.6 46.1,32.6 49.7,29 55.6,29 v55.9,28.7 71,28.7 72.3,30 75.4,30 76.4,29 v80.4,29
ADC0_1  (via drill 0.3)
  Top 0.2: v44.5,40.7 44.5,44.5 44.2,44.8 43.35,44.8 | U3.2 53.26,27.24 53.1,27.4 53.1,28.3 52.7,28.7 50.1,28.7 46.9,31.9 46.9,32.7 46.5,33.1 v46.5,34.2
  Top 0.254: 43.35,44.8 R8.2
  Bottom 0.2: v46.5,34.2 46.5,34.9 46.2,35.2 46.2,40.2 45.7,40.7 v44.5,40.7
ADC0_2  (via drill 0.3)
  Top 0.2: U4.2 84.26,27.24 83.8,27.7 v83.8,28 | 75.05,45 79.32,45 v82.19,42.13
  Top 0.254: 75.05,45 R28.2
  Bottom 0.2: v83.8,28 83.8,34.1 82.19,35.71 v82.19,42.13
ADC1_1  (via drill 0.3)
  Top 0.2: U3.4 55.15,28.25 55.7,27.7 v56,27.7 | v64.4,27.4 64.4,35.6 63.5,36.5 63.5,39.4 v62.2,40.7 | R6.2 v60.5,44.85
  Bottom 0.2: v62.2,40.7 62.2,43.15 v60.5,44.85 | v64.4,27.4 61.4,27.4 60.6,28.2 56.5,28.2 v56,27.7
ADC1_2  (via drill 0.3)
  Top 0.2: U4.4 86.36,28.25 v86.4,28.3 | 87.35,44.7 85.3,44.7 v84.3,43.7
  Top 0.254: 87.35,44.7 R26.2
  Bottom 0.2: v84.3,43.7 84.3,29.7 85.2,28.8 85.9,28.8 v86.4,28.3
ADDR0_1
  Top 0.2: U3.7 55.15,29.75 55.4,30 56,30 56.2,30.2 56.2,33.8 56.4,34 R20.2 57.15,34.65 57.4,34.9 61,34.9 61.89,34.01 SW1.1
ADDR0_2
  Top 0.2: U4.7 86.25,29.75 86.6,30.1 86.6,33.8 86.9,34.1 R40.2 | R40.2 87.53,33.27 87.8,33 91.3,33 92.69,34.39 SW2.1
  Top 0.254: R40.2
ADDR1_1  (via drill 0.3)
  Top 0.2: R21.2 57.15,31.05 57.5,30.7 61.25,30.7 61.89,30.06 SW1.2 62.08,29.93 63.6,31.45 63.6,35.2 62.7,36.1 62.7,37.44 v60.72,39.42 | U3.20 49.24,32.86 49.7,32.4 v50.1,32.4
  Bottom 0.2: v50.1,32.4 50.1,33.3 48.7,34.7 48.7,38.8 49.3,39.4 49.31,39.4 50.58,40.67 59.48,40.67 v60.72,39.42
ADDR1_2
  Top 0.2: R41.2 87.52,30.88 87.8,30.6 91.44,30.6 91.44,30.68 SW2.2 93.23,31.93 94.3,33 94.3,36.8 89.8,41.3 79.17,41.3 78.12,40.25 78.12,35.9 78.33,35.7 79.7,35.7 80.14,35.26 U4.20
BRD_RESET  (via drill 0.3)
  Top 0.406: X2.6 28.5,46.06 28.5,40.9 33.28,36.12 33.28,34.8 | 33.28,34.8 U2.3 33.39,33.6 35.8,33.6 36.96,32.44 S2.P$2 | v28.5,35.7 32.38,35.7 33.28,34.8
  Bottom 0.406: X1.15 9.29,35.49 10.7,36.9 27.3,36.9 v28.5,35.7
DVDD
  Top 0.2: 44.05,36.65 C7.1 45.8,35.4 46.35,34.85 46.95,34.85 47.26,34.54 U3.24 47.26,32.04 48.3,31 51.2,31 52.74,32.54 U3.13 52.75,33.71 53.3,33.71 54.9,35.31 55.58,35.31 56.17,35.9 T1.1 58.75,38.32 C5.1
  Top 0.254: 44.05,36.65 C6.+
FLG
  Top 0.406: U1.4 27.89,23.14 R1.2
GND  (via drill 0.3, 0.6, 0.7, 0.8)
  Top 0.2: U4.42 80.65,26.35 v80.4,26.6 | U4.12 85.12,32.62 v85.5,33 | C17.2 C18.2 | IC1.P$25 20.43,56.17 v20.45,56.2 | IC1.P$18 20.43,48.83 v20.45,48.8 | IC1.P$36 v10.85,57.9 | IC1.P$6 v10.05,47.1 | U4.25 76.68,32.82 v76.5,33 | U4.30 77.85,29.75 v77.9,29.7 77.9,28.6 77.56,28.25 U4.33 | 76.6,22.85 C51.2 | U3.42 49.75,24.05 49.9,23.9 51.1,23.9 51.3,23.7 51.3,22.85 C19.2 | U3.38 47.74,24.34 47.5,24.1 v46.7,24.1 | U4.38 78.64,24.42 78.48,24.26 77.66,24.26 v77.44,24.48 | U3.30 44.85,29.75 v44.5,29.4 44.5,28.6 44.84,28.25 U3.33 | U1.8 21.41,17.32 21.45,17.35
  Top 0.254: C19.2 C20.2
  Top 0.406: 29.23,31.69 C8.2 29.23,31.69 U2.1
  Top 0.5: U1.5 19.25,20.95 19.2,21 | U1.6 19.52,19.68 19.5,19.7 | U1.8 19.55,17.14 19.5,17.1 | U1.7 20.14,18.41 v19.55,19 | 20.2,20.95 19.9,21.25 | 20.55,20.95 20.2,20.95 | 20.2,20.95 19.7,20.45 | 20.5,19.7 20.2,19.7 | 20.2,19.7 19.95,19.95 | 20.2,19.7 19.8,19.3 | 20.7,18.45 20.15,18.45 19.85,18.75 | 20.65,18.4 20.2,18.4 19.75,17.95 | 20.5,17.15 20.2,17.15 | 20.2,17.15 19.9,17.45 | 20.2,17.15 19.85,16.8
  Top 0.61: v82.2,18.8 82.25,18.85 C50.2 C49.2 | C47.2 C48.2 86.25,18.85 v86.2,18.75 | C51.2 C52.2 76.55,18.8 v76.5,18.75 | R38.1 C64.2 | C61.2 R35.1 | R30.1 C57.2 | R31.1 C58.2 | R11.1 C28.2 | R10.1 C27.2 | C34.2 R18.1 | C31.2 R15.1 | C3.2 v15.25,46.3 C4.2 | C32.2 R16.1 | R17.1 C33.2 | R36.1 C62.2 | C36.2 v88.98,38.4 | C7.2 45.48,38.67 C6.- | C46.2 90.25,20.62 C45.- 90.6,20.27 v90.6,18.75 | C16.2 59.35,20.62 C15.- 59.7,20.27 v59.7,18.8
  Top 0.813: C8.2 27.43,31.93 v27.4,31.9 | 32.8,19.77 C2.- | 21.7,20.7 21.7,17.35 21.45,17.35 21,17.35 21,20.7
  Top 1.016: C2.- v34.35,19.8 | v34.35,18.1 v32.8,18.1 32.8,19.77 | J1.GNDBREAK 19.1,8.04 C1.2 17.6,13.05 v17.45,12.9
  Bottom 1.016: v19.55,19 28.25,19 29.05,19.8 v34.35,19.8 | S1.3 24.47,14.08 v19.55,19 | J1.GND 18.76,7.29 J1.GNDBREAK | v19.55,19 19.4,19 17.45,17.05 v17.45,12.9
  other vias: 51.6,18.8 55.3,18.8 8.45,47.1 6.85,47.1 85.1,26.1 90.5,32 90.5,29.75 54.6,26 48.2,40.1 60,31.8 60,29.6 61.11,36.49 55.1,33 76.3,40.6 90.45,34.35 45.5,33.3 42.05,38.4 83.05,40.17 32.8,16.6
  pour Route2 (isolate 0.254): 10.9,59.5 10.9,50.95 0,50.95 0,0 9.7,0 9.7,22.2 29.65,22.2 29.65,25.15 31.7,25.15 31.7,20.85 35.15,20.85 35.15,18.75 29.75,18.75 29.75,-0.05 112,-0.05 112,59.5
  pour Bottom (isolate 0.254): 10.9,59.5 10.9,50.95 0,50.95 0,0 9.7,0 9.7,22.2 29.65,22.2 29.65,25.15 31.7,25.15 31.7,20.85 35.15,20.85 35.15,18.75 29.75,18.75 29.75,-0.1 112,-0.1 112,59.5
  pour Top (isolate 0.254): 10.9,59.5 10.9,50.95 0,50.95 0,0 9.7,0 9.7,22.2 29.65,22.2 29.65,25.15 31.7,25.15 31.7,20.85 35.15,20.85 35.15,18.75 29.75,18.75 29.75,-0.05 112,-0.05 112,59.5
  pour Top (isolate 0.254): 20,21.6 20,16.5 10.7,16.5 10.7,21.6
MCLKI  (via drill 0.6)
  Top 0.2: U4.32 75.26,28.74 v75.1,28.9 | U3.32 47.26,28.74 v47.3,28.7
  Top 0.61: R23.2 v62.3,26.4
  Bottom 0.61: v75.1,28.9 72.3,28.9 69.8,26.4 v62.3,26.4 55.6,26.4 53.8,28.2 47.8,28.2 v47.3,28.7
MP1_1  (via drill 0.3)
  Top 0.2: U3.10 55.55,31.25 55.8,31.5 55.8,34.3 56.9,35.4 61.2,35.4 61.95,36.15 v61.95,37.25 | v45.5,43.2 45.5,40.4 45,39.9 41.6,39.9 40.7,40.8 34,40.8 33.4,40.2 33.4,38.29 SV1.1
  Bottom 0.2: 59.8,41.4 49.3,41.4 47.5,43.2 v45.5,43.2 | 59.8,41.4 | v61.95,37.25 61.95,39.25 59.8,41.4
MP1_2  (via drill 0.3)
  Top 0.2: U4.10 86.05,31.25 86.2,31.4 v86.2,34.5
  Bottom 0.2: v86.2,34.5 86.2,43.1 84.6,44.7 76.9,44.7 74.1,41.9 64.9,41.9 63.65,40.65 63.65,38.79 SV2.1
MP2_1
  Top 0.2: U3.29 44.34,30.26 43.4,31.2 43.4,33.6 43.25,33.75 38.55,33.75 35.9,36.4 35.9,38.33 SV1.2
MP2_2
  Top 0.2: U4.29 75.54,30.26 74.85,30.95 74.85,33.35 74.1,34.1 68.95,34.1 66.2,36.85 66.2,38.78 SV2.2
MP3_1
  Top 0.2: U3.28 44.51,30.75 43.85,31.4 43.85,33.8 43.55,34.1 40.13,34.1 SV1.3
MP3_2
  Top 0.2: U4.28 75.66,30.75 75.25,31.15 75.25,33.5 74.25,34.5 70.48,34.5 SV2.3
MP7_1  (via drill 0.3)
  Top 0.2: U3.14 52.26,32.56 51.4,31.7 v50.7,31.7
  Bottom 0.2: v50.7,31.7 50.7,31.3 50.4,31 48.2,31 47.2,32 47.2,32.6 45.5,34.3 45.5,34.7 45,35.2 43,35.2 41.9,36.3 41.9,36.9 40.5,38.3 38.47,38.3 SV1.4
MP7_2  (via drill 0.3)
  Top 0.2: U4.14 83.16,35.06 v83.6,35.5
  Bottom 0.2: v83.6,35.5 83.9,35.8 83.9,42.1 83,43 75.8,43 74.2,41.4 68.88,41.4 SV2.4
MP8_1
  Top 0.2: U3.27 44.65,31.25 44.25,31.65 44.25,33.95 43.75,34.45 42.32,34.45 SV1.5
MP8_2
  Top 0.2: U4.27 75.75,31.25 75.6,31.4 75.6,33.7 74.4,34.9 71.85,34.9 71.05,35.7 71.05,36.47 SV2.5
MP9_1
  Top 0.2: U3.26 44.84,31.76 44.7,31.9 44.7,34.2 43.95,34.95 42.8,34.95 41.9,35.85 41.9,37.41 SV1.6
MP9_2
  Top 0.2: U4.26 77.66,31.76 77.8,31.9 77.8,32.5 77.2,33.1 77.2,33.85 75.75,35.3 72.7,35.3 72.3,35.7 72.3,37.76 SV2.6
N$1
  Top 0.2: U3.17 50.76,34.68 51.34,35.26 51.34,35.54 52.26,36.45 R3.1 55.04,36.45 T1.3 55,36.4
N$2
  Top 0.2: C24.2 R13.2
N$3  (via drill 0.3)
  Top 0.2: 43.19,20.34 C24.1 | C25.1 C24.1 | v44.41,21.54 44.41,20.57 44.13,20.3 C24.1 | U3.35 46.66,27.24 46.9,27 46.9,26.4 45.04,24.54 v44.71,24.54
  Bottom 0.2: v44.71,24.54 44.71,24.16 44.41,23.85 v44.41,21.54
N$4
  Top 0.2: U3.47 52.26,24.41 52.51,24.16 53.35,24.16 53.65,23.85 C17.1
  Top 0.813: C17.1 C18.1
N$5
  Top 0.61: Y1.P$3 62.35,23.6 R23.1
N$6
  Top 0.2: U3.41 49.24,23.21
  Top 0.254: 49.24,23.21 C19.1
  Top 0.813: C19.1 C20.1
N$7
  Top 0.2: U3.40 48.76,24.16 48.5,23.9 48.5,23.1 48.2,22.8 C21.1
  Top 0.254: 47.4,22.85 C21.1
  Top 0.813: C21.1 C22.1
N$8
  Top 0.2: U3.3 55.05,27.75 55.3,27.5 55.3,25.9 56,25.2 R12.2
N$9
  Top 0.61: R43.1 LED2.A
N$10
  Top 0.61: L1.1 R10.2 C27.1 C10.2
N$12
  Top 0.61: C10.1 R6.1
N$13
  Top 0.61: R2.1 LED1.A
N$15
  Top 0.61: L2.1 R11.2 C28.1 C26.2
N$16
  Top 0.61: C26.1 R8.1
N$19
  Top 0.61: R5.1 51.15,15.66 C9.-
N$20
  Top 0.61: L1.2 56.94,49.06 J3.2
N$21
  Top 0.61: R7.1 59.2,15.47 C23.-
N$22
  Top 0.61: R9.1 39.55,14.82 C29.-
N$24
  Top 0.61: R14.1 47.65,15.56 C30.-
N$26
  Top 0.61: R14.2 C31.1 R15.2 44.05,7.2 J5.2
N$28
  Top 0.61: R9.2 C32.1 R16.2 35.95,7.95 J5.3
N$33
  Top 0.61: J2.2 62.8,10.8 R17.2 C33.1 R7.2
N$34
  Top 0.61: R5.2 C34.1 R18.2 54.75,7.95 J2.3
N$35
  Top 0.61: L2.2 41.44,49.06 J4.2
N$36
  Top 0.2: U4.17 81.66,34.76 83.35,36.45 R24.1 84.7,36.35 86.34,36.35 T2.3
N$37
  Top 0.2: 76.6,36.65 76.6,35 77.88,33.72 U4.24 78.16,32.84 78.5,32.5 78.5,31 79.2,30.3 81.8,30.3 82.4,30.9 82.4,32 83,32.6 83.5,32.6 83.64,32.74 U4.13 83.64,34.64 84.2,35.2 86.95,35.2 87.38,35.62 T2.1 87.38,39.9 C36.1
  Top 0.254: 76.6,36.65 C38.1
  Top 0.813: C38.1 74.12,37.25 C37.+
N$38
  Top 0.2: C54.2 R33.2
N$39  (via drill 0.3)
  Top 0.2: U4.35 77.7,27.24 77.89,27.05 77.89,26.49 77.04,25.64 v77.04,25.28 | v75.43,21.59 74.49,21.59 74.26,21.36 C54.1 | C54.1 | C54.1 C55.1
  Bottom 0.2: v75.43,21.59 75.43,24.33 76.37,25.27 v77.03,25.27 v77.04,25.28
N$40
  Top 0.2: U4.47 83.16,24.34 83.4,24.1 84.3,24.1 84.5,23.9 84.5,22.85 | C47.1 C48.1
  Top 0.254: 84.5,22.85 C47.1
N$41
  Top 0.2: C50.1 C49.1 80.14,23.21 U4.41
N$42
  Top 0.2: U4.40 79.63,24.25 79.28,23.9 78.4,23.9 78.2,23.7 78.2,22.85 | C51.1 C52.1
  Top 0.254: 78.2,22.85 C51.1
N$44  (via drill 0.3)
  Top 0.2: U4.3 85.95,27.75 86.4,27.3 v86.4,26.4 | v86.4,25 87.37,25 R32.2
  Bottom 0.2: v86.4,26.4 v86.4,25
N$46
  Top 0.61: L3.1 R30.2 C57.1 C40.2
N$47
  Top 0.61: C40.1 R26.1
N$48
  Top 0.61: L4.1 R31.2 C58.1 C56.2
N$49
  Top 0.61: C56.1 R28.1
N$50
  Top 0.61: R25.1 89.65,15.56 C39.-
N$51
  Top 0.61: R27.1 97.75,15.38 C53.-
N$52
  Top 0.61: R29.1 78.09,15.62 C59.-
N$53
  Top 0.61: R34.1 86.15,15.28 C60.-
N$54
  Top 0.61: R34.2 C61.1 R35.2 82.55,7.2 J9.2
N$55
  Top 0.61: J9.3 74.5,10.55 R36.2 C62.1 R29.2
N$56
  Top 0.61: J6.2 101.35,7.2 R37.2 C63.1 R27.2
N$57
  Top 0.61: R25.2 C64.1 R38.2 93.3,10.75 J6.3
N$58
  Top 0.61: L3.2 88.26,49.16 J7.2
N$59
  Top 0.61: L4.2 72.14,49.36 J8.2
OUT_BCLK_1  (via drill 0.3)
  Top 0.2: U4.9 83.25,30.75 v83.1,30.9 | U3.19 49.75,34.75 v49.5,35
  Bottom 0.2: v49.5,35 49.6,35.1 50.9,35.1 51.6,34.4 52.7,34.4 53.6,35.3 80.8,35.3 82.4,33.7 82.4,31.6 v83.1,30.9
OUT_BCLK_2  (via drill 0.3)
  Top 0.2: U3.9 52.76,30.75 v52.7,30.8 | v80.3,32.4 80.65,32.75 U4.19
  Bottom 0.2: v52.7,30.8 52,31.5 52,32.3 54.2,34.5 77.5,34.5 79.6,32.4 v80.3,32.4
OUT_LRCLK_1  (via drill 0.3)
  Top 0.2: U4.8 83.36,30.26 v83.1,30 | U3.16 51.24,32.55 v51.3,32.5
  Bottom 0.2: v51.3,32.5 53.7,34.9 80.6,34.9 82,33.5 82,30.5 82.5,30 v83.1,30
OUT_LRCLK_2  (via drill 0.3)
  Top 0.2: U3.8 53.26,30.26 v52.7,29.7 | U4.16 82.14,32.74 81.8,32.4 v81.3,32.4
  Bottom 0.2: v52.7,29.7 53.9,30.9 53.9,33 54.6,33.7 77.1,33.7 78.5,32.3 78.5,31.2 79,30.7 79.6,30.7 v81.3,32.4
PA0A
  Top 0.2: IC1.P$23 21.6,53.7 23.5,51.8 23.5,44.51 JP1.1
PA1  (via drill 0.3)
  Top 0.2: IC1.P$12 v14.85,51.1 | JP1.10 10.05,40.35 9.2,39.5 9.2,13.1 8.6,12.5 8.6,11.25 R2.2
  Top 0.61: R2.2 8.4,11.2 8.4,11
  Bottom 0.2: JP1.10 13,41.63 13,43.6 14.45,45.05 14.45,47.3 14.85,47.7 v14.85,51.1
PB11  (via drill 0.3)
  Top 0.2: IC1.P$15 v17.25,50.4
  Bottom 0.2: v17.25,50.4 17.25,43.34 JP1.5
PB12  (via drill 0.3)
  Top 0.2: IC1.P$14 v16.45,51.1
  Bottom 0.2: JP1.8 15.5,41.59 15.5,43.5 16.65,44.65 16.65,47.2 16.45,47.4 v16.45,51.1
PB13  (via drill 0.3)
  Top 0.2: IC1.P$13 v15.65,50.4
  Bottom 0.2: v15.65,50.4 15.65,47.5 16.15,47 16.15,44.78 JP1.7
PC10A
  Top 0.2: IC1.P$22 21.8,52.9 23.1,51.6 23.1,46 20.6,43.5 20.6,41.61 JP1.4
PC11A
  Top 0.2: IC1.P$21 22.05,52.1 22.75,51.4 22.75,47.25 19.34,43.84 JP1.3
PD13A  (via drill 0.3)
  Top 0.2: IC1.P$11 v14.05,50.4
  Bottom 0.2: v14.05,50.4 14.05,45.8 11.7,43.45 11.7,42.91 JP1.9
PD14  (via drill 0.3)
  Top 0.2: IC1.P$32 14.05,54.2 14.55,53.7 15.45,53.7 v18.05,51.1
  Bottom 0.2: JP1.6 18.1,41.65 18.1,43.5 18.05,43.55 v18.05,51.1
PD15A
  Top 0.2: IC1.P$24 21.4,54.5 23.9,52 23.9,42.37 JP1.2
PSW
  Top 0.406: U1.1 27.89,13.93 S1.2
SCL  (via drill 0.3)
  Top 0.2: U3.23 47.74,32.46 v47.9,32.3 | U4.23 78.64,34.66 78.5,34.8 78.1,34.8 77.4,35.5 77.4,40.9 76.9,41.4 v46.6,41.4 | IC1.P$19 21.4,50.5 22.1,49.8 v22.1,48.6
  Bottom 0.2: v47.9,32.3 47.9,34.2 46.6,35.5 v46.6,41.4 46.5,41.5 30.52,41.5 X2.1 28.52,43.5 25.9,43.5 22.1,47.3 v22.1,48.6
SDA  (via drill 0.3)
  Top 0.2: U4.22 79.15,34.95 78.9,35.2 78.28,35.2 77.78,35.7 77.78,41.17 77.08,41.88 47.52,41.88 v47.1,42.3 | U3.22 48.25,32.85 48.7,32.4 v48.8,32.4 | IC1.P$20 21.6,51.3 v22,50.9
  Bottom 0.2: v48.8,32.4 48.7,32.5 48.7,34 47,35.7 47,40.6 47.4,41 47.4,42 v47.1,42.3 46.4,42.3 46,41.9 32.66,41.9 X2.3 28.46,46.1 26.2,46.1 22,50.3 v22,50.9
SELFBOOT_1
  Top 0.2: U3.6 55.25,29.25 55.6,29.6 R22.2
SELFBOOT_2
  Top 0.2: U4.6 86.35,29.25 86.6,29.5 R42.2
SWCLK
  Top 0.2: IC1.P$9 12.45,49.92 12.08,50.29 5.46,50.29 5.05,49.88 5.05,46.31 7.86,43.5 7.86,27.07 X1.7
SWDIO
  Top 0.2: IC1.P$10 13.25,49.9 12.35,50.8 5.21,50.8 4.49,50.08 4.49,44.39 4.9,43.98 4.9,29.09 X1.9
TDM_OUT_1  (via drill 0.3)
  Top 0.2: U4.11 83.14,31.76 v83.1,31.8 | U3.15 51.75,34.95 v52,35.2
  Bottom 0.2: v52,35.2 52.5,35.7 81,35.7 83.1,33.6 v83.1,31.8
TDM_OUT_2  (via drill 0.3)
  Top 0.2: U3.11 52.84,31.76 v52.9,31.8 | v79.2,31.5 79.2,31 79.5,30.7 81.7,30.7 82,31 82,32.1 82.65,32.75 U4.15
  Bottom 0.2: v52.9,31.8 52.9,32.6 54.4,34.1 77.3,34.1 79.2,32.2 v79.2,31.5
VDD  (via drill 0.3, 0.6, 0.7)
  Top 0.2: U4.48 83.92,25.28 85.2,24 88.3,24 88.5,23.8 88.5,22.85 | U3.18 50.25,36.4 | C12.1 48.5,36.65 | IC1.P$8 11.65,46.35 | U4.39 79.15,26.45 v78.94,26.66 | 84.7,38.25 R24.2 | U3.39 48.25,26.65 v48.3,26.7 | U3.48 53.41,25.28 54.72,23.98 57.44,23.98 57.64,23.77 C16.1 | T1.2 57.97,36.28 v58.03,36.35 | U4.18 81.15,36.93 C42.1 | U4.34 74.85,27.75 C43.1 | U4.36 76.68,26.18 76.1,25.6 74.8,25.6 C44.1 | U3.34 43.6,27.75 C14.1 | C13.1 43.45,25.5 45.3,25.5 45.8,26 45.8,26.74 U3.36 | R39.2 90.3,27.2 v90.6,27.5 | R19.2 v60,27.4
  Top 0.254: 88.5,22.85 C46.1 | 79.2,36.95 C41.+ | 50.25,36.4 C12.1 | 48.5,36.65 C11.+ | 11.65,46.35 C3.1 | IC1.P$17 18.85,46.35 C4.1
  Top 0.406: 29.02,33.6 C8.1 29.09,33.73 U2.4 | U1.3 30.69,19.68 C2.+
  Top 0.61: C4.1 v20.55,46.3 | C3.1 11.7,44.95 v11.55,44.8 | C12.1 50.35,36.4 51.4,36.4 51.9,36.9 v51.9,37.2 52.85,38.15 R3.2 | T2.2 89.53,36.28 v89.57,36.24 | R13.1 37.72,20.3 v37.72,18.73 38.2,18.25 C25.2 | R33.1 68.83,20.18 v68.83,18.7 69.33,18.2 C55.2 | C46.1 88.55,20.62 C45.+ 88.25,20.27 v88.25,18.75 | C16.1 57.65,20.62 C15.+ 57.3,20.27 v57.3,18.8 | C43.1 C44.1 74.48,25.28 v74.48,23.71 | C14.1 C13.1 43.28,25.27 v43.28,23.41 | 66.2,21.85 66.2,20.43 v66.13,20.3 | Y1.P$4 66.2,21.85 | 66.2,21.85 C35.1 | R43.2 8.5,8.6 8.5,7.2 v8.6,7.1
  Top 0.813: C8.1 27.47,33.63 v27.4,33.7 | R24.2 83.55,38.15 v83.1,37.7 82.65,37.25 C42.1 79.62,37.25 C41.+ | v30.69,21.64 v30.7,21.65
  Top 1.016: 30.69,19.68 v30.69,21.64 | 30.7,21.7 v30.7,22.95 v30.7,24.25
  pour Route3 (isolate 0.254): 10.9,59.5 10.9,50.95 0,50.95 0,0 9.7,0 9.7,22.2 29.65,22.2 29.65,20.85 33.6,20.85 33.6,18.75 29.75,18.75 29.75,-0.05 112,-0.05 112,59.5
VIN
  Top 0.406: R1.1 26.25,18.55 26.11,18.41
  Top 0.61: U1.2 26.11,18.41 26.1,18.4
  Top 1.016: J1.PWR 15,12.7 17.05,14.75 C1.1 22.45,14.75 | 22.45,14.75 26.1,18.4 | S1.1 24.7,9 23.5,10.2 23.5,13.7 22.45,14.75
VOUT0_1  (via drill 0.3)
  Top 0.2: U3.46 51.75,27.25 v51.7,27.3 | C23.+ 61.8,15.97 61.8,17.4 61.42,17.77 57.73,17.77 v57.7,17.8
  Bottom 0.2: v51.7,27.3 52.5,26.5 52.5,18.8 53.5,17.8 v57.7,17.8
VOUT0_2  (via drill 0.3)
  Top 0.2: U4.46 82.65,26.35 v82.9,26.6 | C53.+ 95.28,17.62 v95.2,17.7
  Bottom 0.2: v82.9,26.6 82.9,24.6 83.4,24.1 83.4,20.15 85.6,17.95 94.95,17.95 v95.2,17.7
VOUT1_1
  Top 0.2: U3.45 51.24,24.33 51.67,23.9 52.23,23.9 52.51,23.62 52.51,18.82 53.53,17.81 54.15,17.81 54.41,17.54 C9.+
VOUT1_2  (via drill 0.3)
  Top 0.2: U4.45 82.14,27.84 | v84.5,17.9 91.9,17.9 92.3,17.5 92.3,15.96 C39.+
  Top 0.254: 82.14,27.84 v82.2,27.9
  Bottom 0.2: v82.2,27.9 82.1,27.8 82.1,24.7 83,23.8 83,19.4 v84.5,17.9
VOUT2_1  (via drill 0.3)
  Top 0.2: U3.44 50.76,26.44 v49.9,27.3 | C30.+ 45.19,17.5 45.47,17.77 v46.56,17.77
  Top 0.254: 44.6,15.72 C30.+
  Bottom 0.2: v49.9,27.3 49.9,25.4 48.5,24 48.5,18.9 47.4,17.8 46.59,17.8 v46.56,17.77
VOUT2_2  (via drill 0.3)
  Top 0.2: U4.44 81.66,27.34 v81.3,27.7 | 82.78,15.65 82.33,16.1 v80.8,16.1 | 82.8,15.62 82.78,15.65 | 82.78,15.65 C60.+
  Top 0.254: 83.2,16.02 C60.+
  Bottom 0.2: v81.3,27.7 81.3,24.3 80.9,23.9 79.6,23.9 79.4,23.7 79.4,17.5 v80.8,16.1
VOUT3_1  (via drill 0.3)
  Top 0.2: U3.43 50.25,26.45 50.1,26.6 v49.2,26.6 | C29.+ 43.51,15.95 v43.55,15.99
  Bottom 0.2: v49.2,26.6 49.2,25.29 44.41,20.5 44.41,16.85 v43.55,15.99
VOUT3_2  (via drill 0.3)
  Top 0.2: U4.43 81.15,26.95 80.6,27.5 v80.4,27.5 | C59.+ 75.58,17.45 75.88,17.76 78.09,17.76 v78.37,18.03
  Bottom 0.2: 80.4,27.48 v80.4,27.5 80.37,27.5 79.77,26.9 79.77,25.37 78.4,24 78.4,18.07 v78.37,18.03
WP_1
  Top 0.2: U3.21 48.76,34.84 48.5,35.1 47.2,35.1 46.95,35.35 46.95,40.16 47.81,41.02 60.18,41.02 63.1,38.1 63.1,36.3 63.95,35.45 63.95,29.95 62.6,28.6 57.6,28.6 57.15,28.15 R19.1
WP_2  (via drill 0.3)
  Top 0.2: v81.3,31.4 80.3,31.4 79.6,32.1 79.6,32.8 79.66,32.85 U4.21 | v83,28.3 83,27.5 84.3,26.2 84.3,26 v85.1,25.2 | v92,26.1 87.9,26.1 87.52,26.48 R39.1
  Bottom 0.2: v81.3,31.4 81.3,30 v83,28.3 | v85.1,25.2 84.4,25.9 84.4,26.9 84.7,27.2 87.35,27.2 88.45,26.1 v92,26.1

### Text on the board
tPlace: L1 | R1 | L2 | R2 | SigmaMIX | v0.5 | PD13/PB13/PB11/PC11/PA00 / PA01/PB12/PD14/PC10/PD15 | MP2/MP7/MP9 / MP1/MP3/MP8 | VDD x6 / GND x6 | ADDR0 | RESET | ADDR1 | ADDR0 | ADDR1 | VDD x6 / GND x6 | 5-16V | 4 | 3 | 2 | 1 | for Turntablism & Portablism